# EAGLE design DOG_DisplayBreakout_Switched (EAGLE 7.7.0)
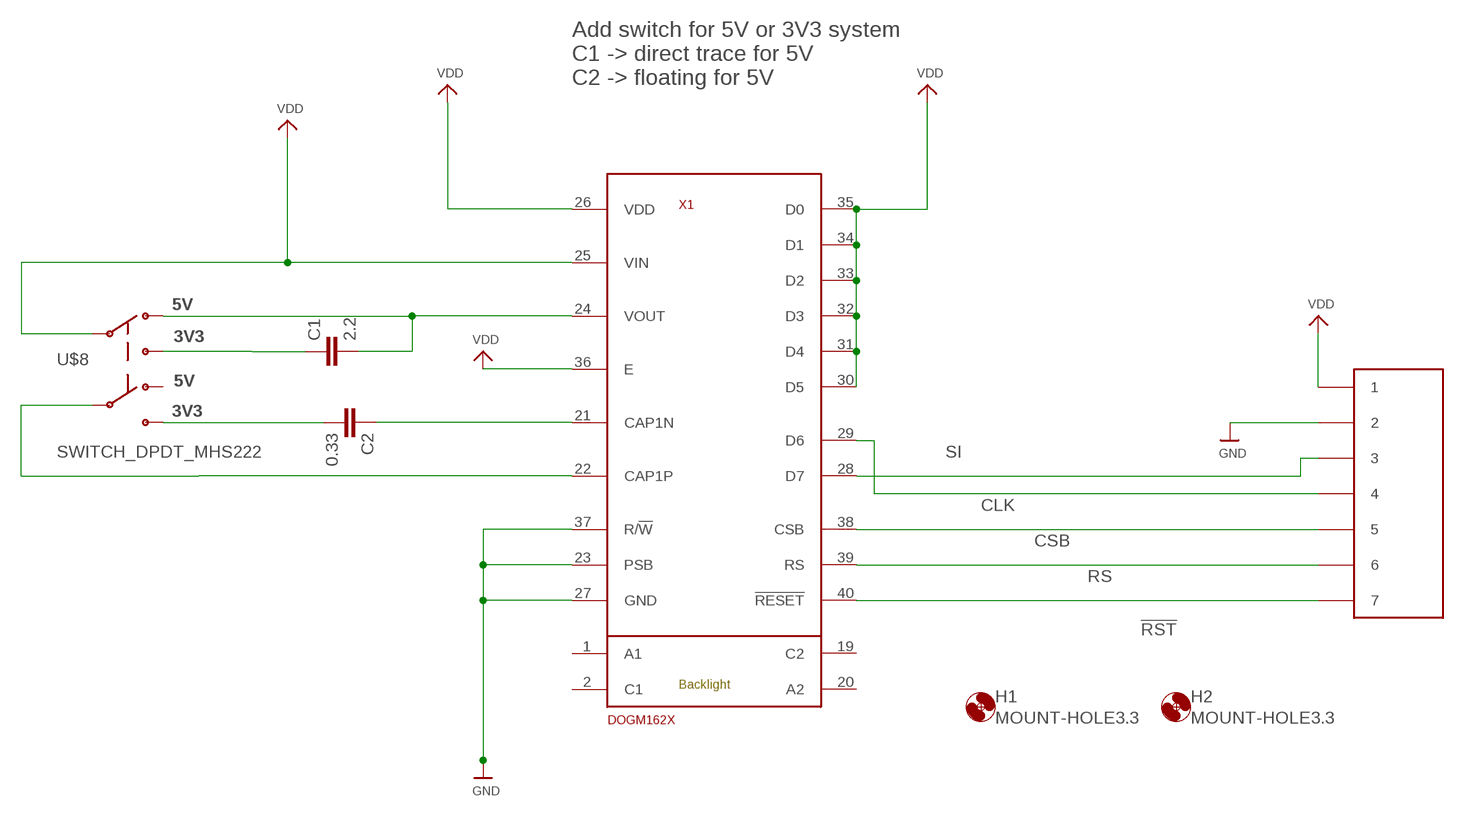
[diagram p0: schematic, sheet 1]

## Parts
C1  2.2  CAPACITOR0805  [0805_BIGGERPAD-OK]
C2  0.33  CAPACITOR0805  [0805_BIGGERPAD-OK]
CN1  JST_S7B-PH-K-S  [JST_S7B-PH-K-S]
H1  MOUNT-HOLE3.3  [HOLE3,3]
H2  MOUNT-HOLE3.3  [HOLE3,3]
U$8  SWITCH_DPDT_MHS222  [SWITCH_MHS222]
X1  DOGM162X  [DOGM162X]

## Nets
!RST: CN1.P7 X1.40(!RESET)
CAP1_3V3: C2.2 U$8.P$6
CAP1N: C2.1 X1.21(CAP1N)
CAP1P: U$8.P$5 X1.22(CAP1P)
CLK: CN1.P4 X1.29(D6)
CSB: CN1.P5 X1.38(CSB)
GND: CN1.P2 X1.23(PSB) X1.27(GND) X1.37(R/!W)
RS: CN1.P6 X1.39(RS)
SI: CN1.P3 X1.28(D7)
VDD: CN1.P1 U$8.P$2 X1.25(VIN) X1.26(VDD) X1.30(D5) X1.31(D4) X1.32(D3) X1.33(D2) X1.34(D1) X1.35(D0) X1.36(E)
VOUT: C1.2 U$8.P$1 X1.24(VOUT)
VOUT_3V3: C1.1 U$8.P$3
Unconnected: U$8.P$4 X1.1(A1) X1.2(C1) X1.19(C2) X1.20(A2)

## Notes on the sheet
- Add switch for 5V or 3V3 system
  C1 -> direct trace for 5V
  C2 -> floating for 5V
- 5V
- 3V3
- 5V
- 3V3

## Library data of the parts
C1 C2 = DMF-Bigger_SMD_footprints:CAPACITOR: Capacitor Standard 0603 ceramic capacitor, and 0.1" leaded capacitor.
CN1 = DMF-Additional_Supply_dmf:JST_S7B-PH-K-S
H1 H2 = DMF-Audio_Connectors:MOUNT-HOLE: MOUNTING HOLE with drill center marker
U$8 = DMF_MasterLibrary:SWITCH_DPDT_MHS222: Nidec Copal Electronics MHS222 Digikey 563-1575-ND
X1 = DMF_Displays:DOGM162X: DOGM Character Display http://www.lcd-module.com/products/dog.html

## Board
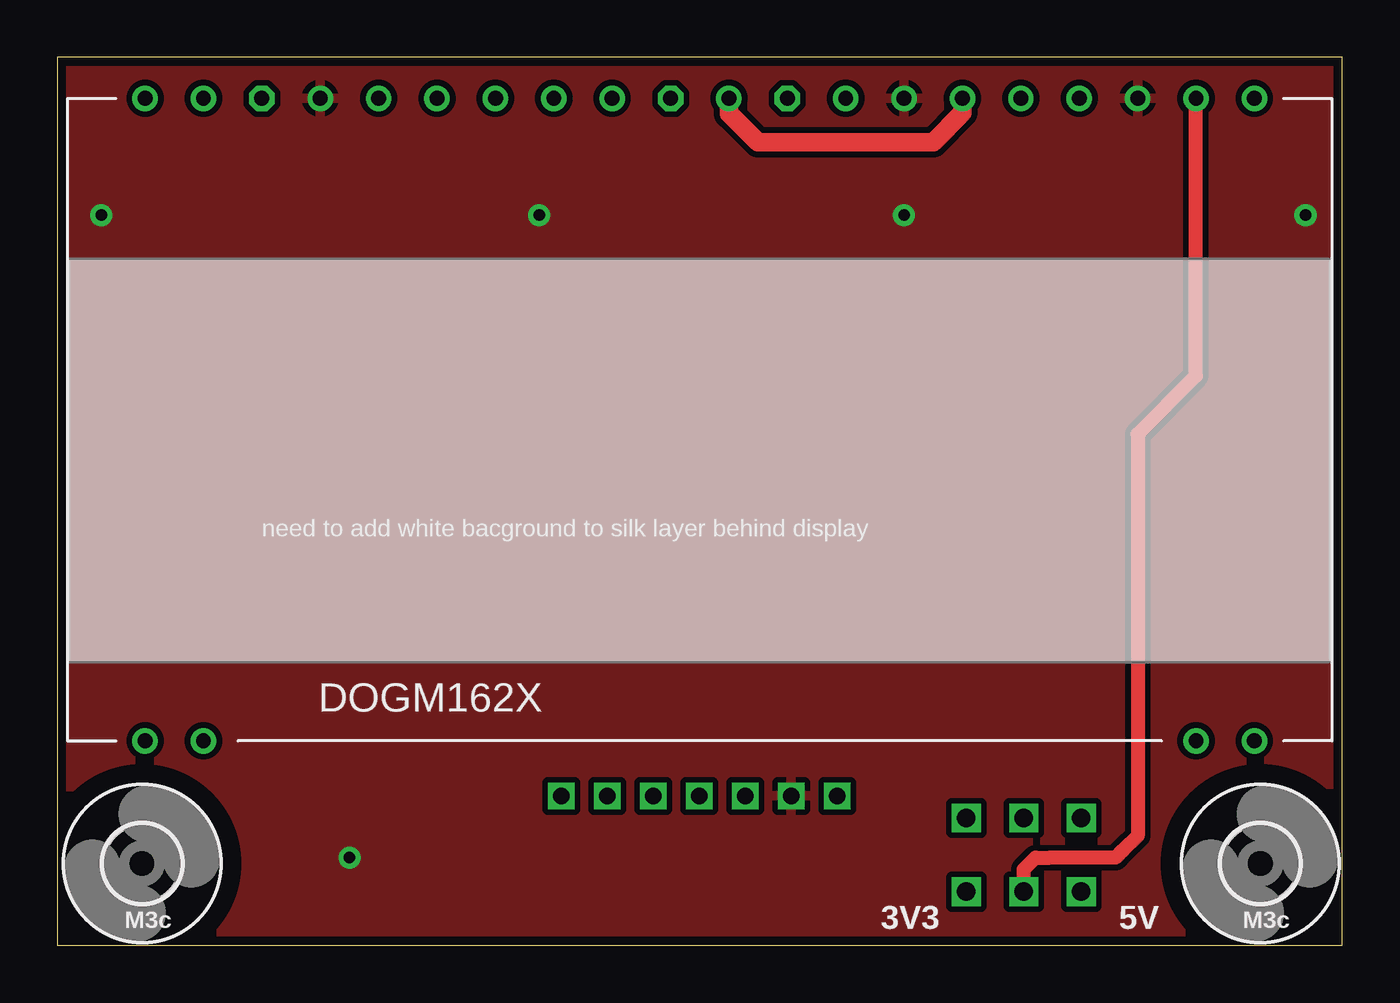
[diagram p1: board, top side]
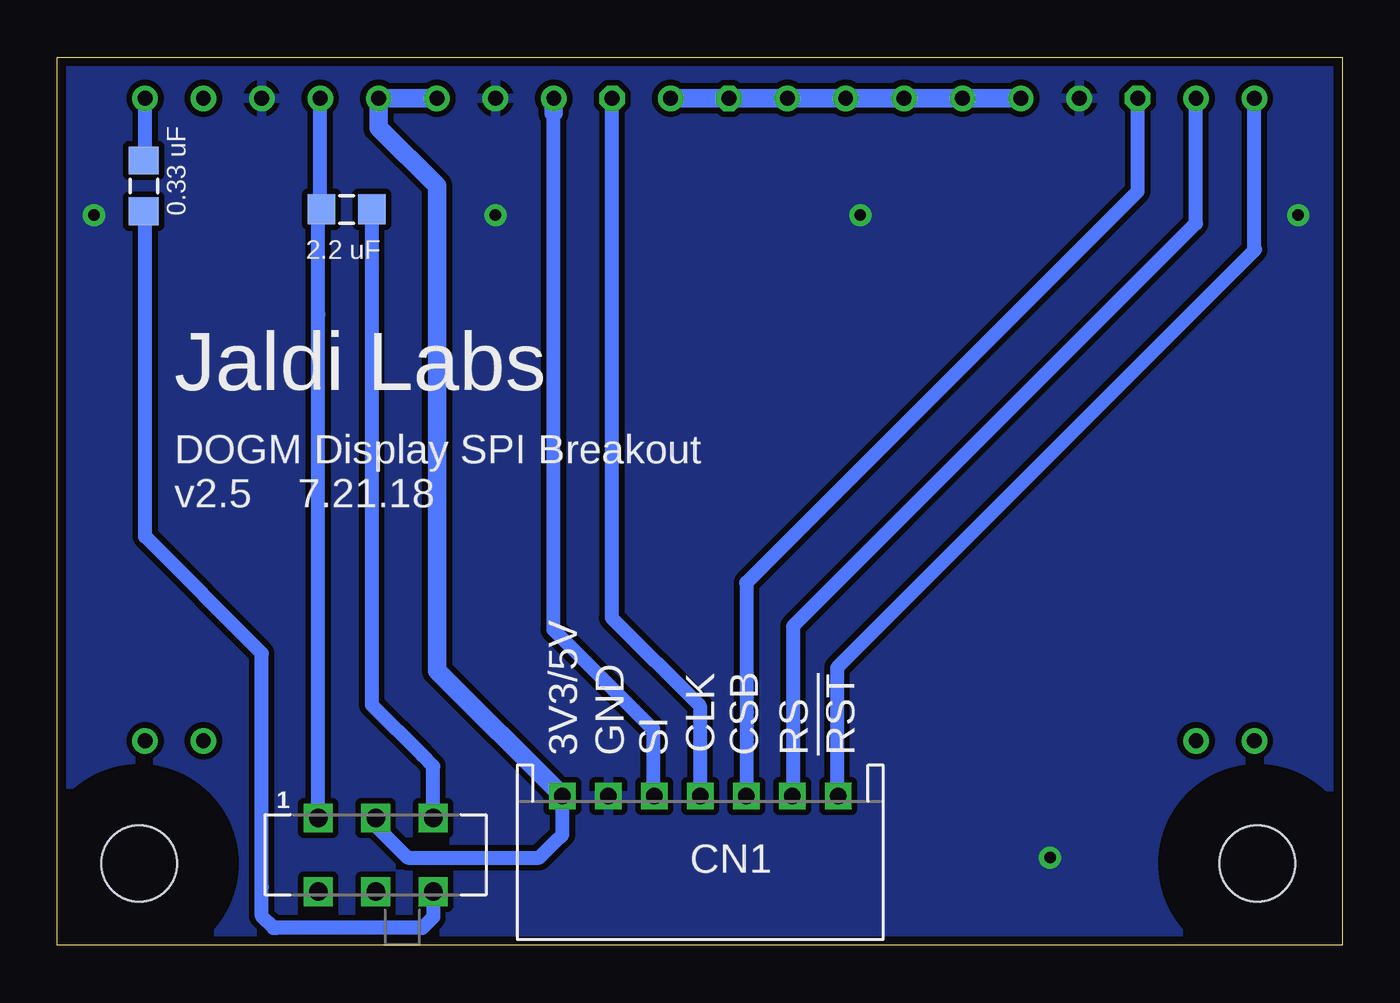
[diagram p2: board, bottom side, seen from below]

Size 55.88 x 38.61 mm. Coordinates in mm from the lower left corner, seen from the top.
Outline: 0,0 55.88,0 55.88,38.61 0,38.61 0,0
Copper layers (1*16): Top 0.0356mm / dielectric 1.5011mm / Bottom 0.0356mm
Design rules "DMF-LaenSparkFunMod": minimum track width 6mil, minimum drill 13mil, track to track 6mil, track to pad 6mil, pad to pad 6mil, via to via 6mil, smd to smd 6mil, copper to edge 15mil, drill to drill 6mil, minimum pad ring 9mil, minimum via ring 9mil, stop-mask expansion 3mil, vias tented up to drill 25mil, thermal gap 10mil

### Footprints (pad centres in the part's own frame; a part is rotated, then mirrored left to right if it is on the bottom)
0805_BIGGERPAD-OK = smd 1.2 x 1.3: 1 -1.1,0; 2 1.1,0
JST_S7B-PH-K-S = drill 0.7 square: P1 1.96,6.24; P2 3.96,6.24; P3 5.96,6.24; P4 7.96,6.24; P5 9.96,6.24; P6 11.96,6.24; P7 13.96,6.24
HOLE3,3 = hole 3.3: 0,0
SWITCH_MHS222 = drill 0.8 square: P$1 -2.5,1.6; P$2 0,1.6; P$3 2.5,1.6; P$4 -2.5,-1.6; P$5 0,-1.6; P$6 2.5,-1.6
DOGM162X = drill 0.65: 1 -24.13,-13.97; 2 -21.59,-13.97; 19 21.59,-13.97; 20 24.13,-13.97; 21 24.13,13.97; 22 21.59,13.97; 23 19.05,13.97; 24 16.51,13.97; 25 13.97,13.97; 26 11.43,13.97; 27 8.89,13.97; 28 6.35,13.97; 30 1.27,13.97; 32 -3.81,13.97; 33 -6.35,13.97; 34 -8.89,13.97; 35 -11.43,13.97; 36 -13.97,13.97; 37 -16.51,13.97; 39 -21.59,13.97; 40 -24.13,13.97 | drill 0.65 octagon: 29 3.81,13.97; 31 -1.27,13.97; 38 -19.05,13.97

### Placement (x,y rotation side)
C1  43.31,32 180 bottom
C2  52.12,33.02 270 bottom
CN1  35.88,0.25 0 bottom
H1  3.68,3.56 0 top
H2  52.32,3.56 0 top
U$8  42.04,3.94 0 bottom
X1  27.94,22.86 0 top

### Tracks (layer width: path | path; a pad name or v marks a point on that pad's centre or on a via)
!RST
  Bottom 0.61: 21.97,6.55 21.97,12.06 3.79,30.25 3.81,30.25 X1.40
  Bottom 0.813: 21.97,6.55 CN1.P7
CAP1_3V3
  Bottom 0.61: U$8.P$6 39.54,1.23 40.01,0.76 46.35,0.76 46.48,0.76 46.99,1.27 46.99,2.54 46.99,12.7 52.07,17.78 52.07,30.6 52.07,31.87 C2.2
CAP1N
  Top 0.813: 52.07,36.85 X1.21
  Bottom 0.406: C2.1 52.07,34.12
  Bottom 0.61: 52.07,34.12 X1.21
CAP1P
  Top 0.61: U$8.P$5 42.04,3.3 42.55,3.81 43.18,3.81 46.04,3.81 46.35,4.13 46.99,4.76 46.99,22.23 49.53,24.77 X1.22
CLK
  Bottom 0.61: 27.94,6.52 27.94,10.41 31.77,14.25 31.75,14.25 X1.29
  Bottom 0.813: 27.94,6.52 CN1.P4
CSB
  Bottom 0.61: 25.91,6.5 25.91,15.75 25.91,15.77 8.89,32.79 X1.38
  Bottom 0.813: 25.91,6.5 CN1.P5
GND  (via drill 0.5)
  other vias: 20.95,31.75 54.29,31.75 1.91,31.75 36.83,31.75 12.7,3.81
  pour Bottom (isolate 0.254): -1.27,40.01 58.42,40.01 59.69,-2.54 -2.54,-2.54
  pour Top (isolate 0.254): -2.54,40.64 59.05,40.64 58.42,-1.91 -2.54,-2.54
RS
  Bottom 0.61: 23.88,6.54 23.88,13.84 23.88,13.87 6.35,31.39 X1.39
  Bottom 0.813: 23.88,6.54 CN1.P6
SI
  Bottom 0.61: 29.97,6.55 29.97,9.4 34.31,13.74 34.29,13.74 34.29,36.2
  Bottom 0.813: 29.97,6.55 CN1.P3 | 34.29,36.2 X1.28
VDD
  Top 0.61: 39.37,36.8 X1.26
  Top 0.813: X1.30 29.21,36.17 29.23,36.17 30.48,34.92 31.11,34.92 37.47,34.92 38.1,34.92 39.37,36.2 39.37,36.8
  Bottom 0.61: U$8.P$2 42.04,5.21 40.64,3.81 34.92,3.81 34.29,4.45 33.92,4.82 CN1.P1
  Bottom 0.813: X1.30 X1.31 X1.32 X1.33 X1.34 X1.35 X1.36 | 33.92,6.61 CN1.P1 39.37,11.95 39.37,12.06 39.37,32.38 39.37,33.02 41.91,35.56 X1.25 X1.26
VOUT
  Bottom 0.406: 44.48,32.07 44.45,32.07
  Bottom 0.61: U$8.P$1 44.54,27.43 44.54,31.87 C1.2 44.48,32.07 | 44.45,32.07 X1.24
VOUT_3V3
  Bottom 0.61: C1.1 42.21,10.46 40.01,8.26 39.54,7.79 U$8.P$3

### Text on the board
tNames: 3V3 | 5V
bNames: 0.33 uF | 2.2 uF | Jaldi Labs | DOGM Display SPI Breakout / v2.5 7.21.18 | !RST | RS | CSB | CLK | SI | GND | 3V3/5V